# Altium project KeyBoard.PrjPcb
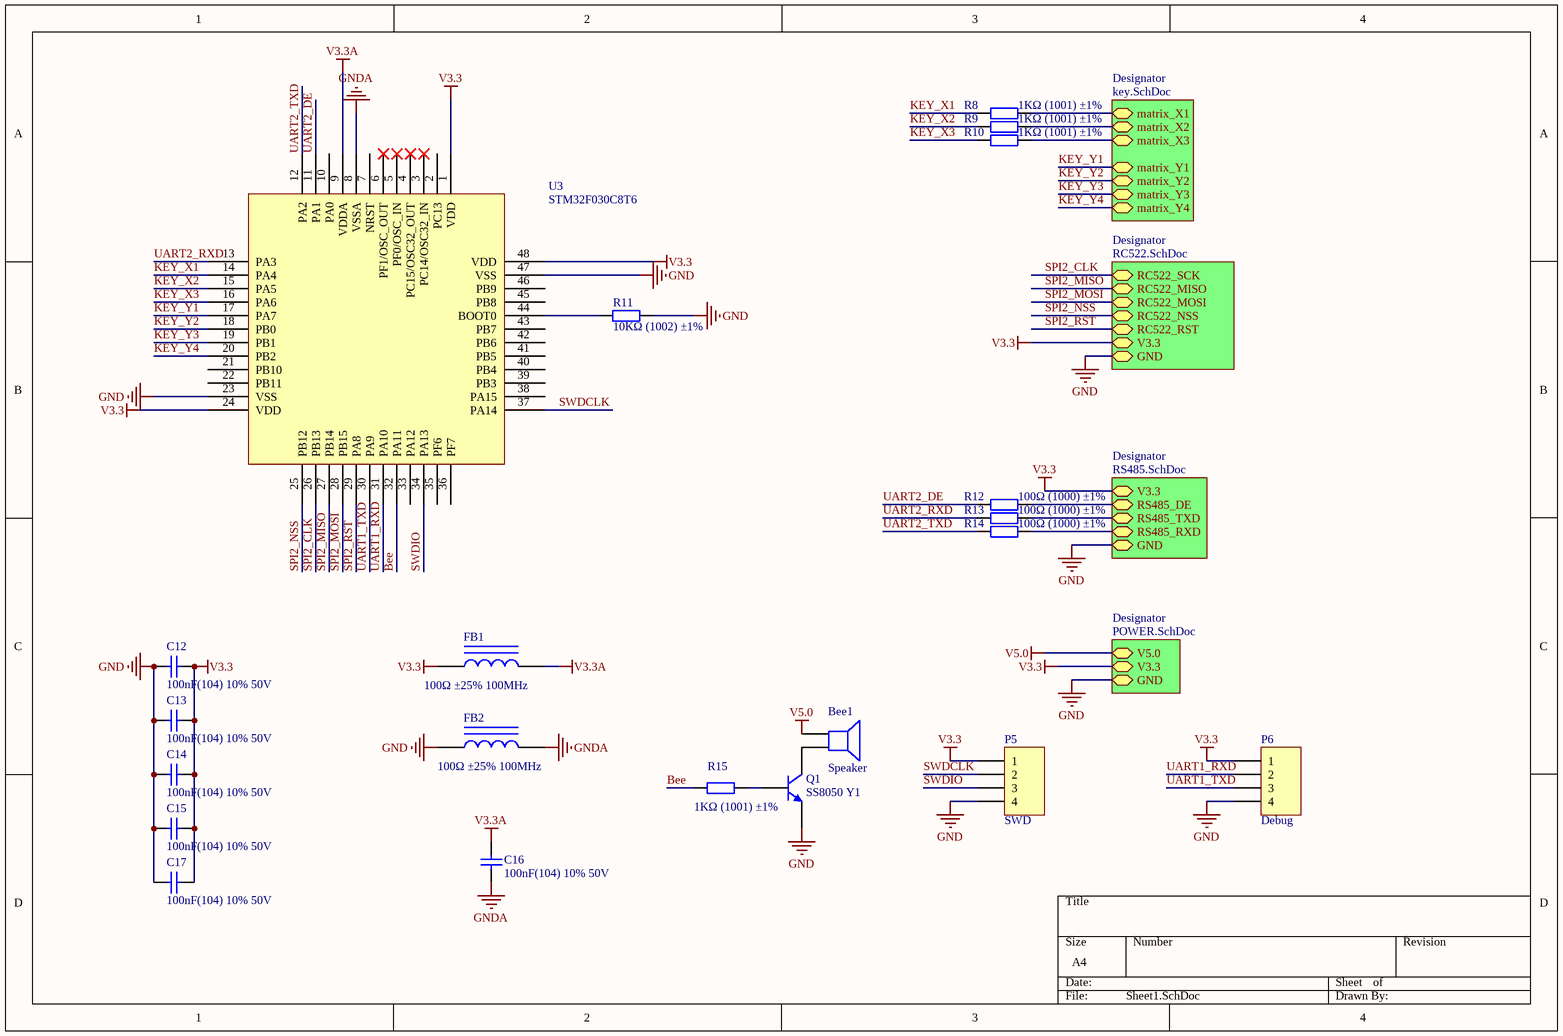
[diagram p0: Sheet1.SchDoc]
5 sheets, 49 parts. Net scope: strictly hierarchical (ports join the sheet entries above them; power ports are local).
Board file: PCB.PcbDoc
Sheets:
  Sheet1.SchDoc
    Designator = key.SchDoc
    Designator = RC522.SchDoc
    Designator = RS485.SchDoc
    Designator = POWER.SchDoc

## Sheet Sheet1.SchDoc
size A4

### Parts
Bee1  Speaker  [Bee]
C12  100nF(104) 10% 50V  [0805_C]
C13  100nF(104) 10% 50V  [0805_C]
C14  100nF(104) 10% 50V  [0805_C]
C15  100nF(104) 10% 50V  [0805_C]
C16  100nF(104) 10% 50V  [0805_C]
C17  100nF(104) 10% 50V  [0805_C]
FB1  100Ω ±25% 100MHz  [0805_L]
FB2  100Ω ±25% 100MHz  [0805_L]
P5  SWD  [HDR1X4]
P6  Debug  [HDR1X4]
Q1  SS8050 Y1  [SOT-23(SOT-23-3)]
R8  1KΩ (1001) ±1%  [0805_R]
R9  1KΩ (1001) ±1%  [0805_R]
R10  1KΩ (1001) ±1%  [0805_R]
R11  10KΩ (1002) ±1%  [0805_R]
R12  100Ω (1000) ±1%  [0805_R]
R13  100Ω (1000) ±1%  [0805_R]
R14  100Ω (1000) ±1%  [0805_R]
R15  1KΩ (1001) ±1%  [0805_R]
U3  STM32F030C8T6  [LQFP-48_7x7x05P]

### Sub-sheets
Designator = key.SchDoc: matrix_Y2, matrix_Y4, matrix_X1, matrix_Y1, matrix_X3, matrix_Y3, matrix_X2
Designator = RC522.SchDoc: RC522_SCK, RC522_MISO, RC522_MOSI, RC522_NSS, V3.3, RC522_RST, GND
Designator = RS485.SchDoc: V3.3, RS485_RXD, RS485_TXD, RS485_DE, GND
Designator = POWER.SchDoc: V5.0, V3.3, GND

### Nets
GND: C12.1 C13.1 C14.1 C15.1 C17.1 FB2.1 P5.4 P6.4 Q1.2(E) R11.2 U3.23(VSS) U3.47(VSS) ; sheet Designator/GND, sheet Designator/GND, sheet Designator/GND
GNDA: C16.1 FB2.2 U3.8(VSSA)
V3.3: C12.2 C13.2 C14.2 C15.2 C17.2 FB1.1 P5.1 P6.1 U3.1(VDD) U3.24(VDD) U3.48(VDD) ; sheet Designator/V3.3, sheet Designator/V3.3, sheet Designator/V3.3
V3.3A: C16.2 FB1.2 U3.9(VDDA)
V5.0: Bee1.1 ; sheet Designator/V5.0
Bee: R15.1 U3.32(PA11)
KEY_X1: R8.1 U3.14(PA4)
KEY_X2: R9.1 U3.15(PA5)
KEY_X3: R10.1 U3.16(PA6)
KEY_Y1: U3.17(PA7) ; sheet Designator/matrix_Y1
KEY_Y2: U3.18(PB0) ; sheet Designator/matrix_Y2
KEY_Y3: U3.19(PB1) ; sheet Designator/matrix_Y3
KEY_Y4: U3.20(PB2) ; sheet Designator/matrix_Y4
matrix_X1: R8.2 ; sheet Designator/matrix_X1
matrix_X2: R9.2 ; sheet Designator/matrix_X2
matrix_X3: R10.2 ; sheet Designator/matrix_X3
RS485_DE: R12.2 ; sheet Designator/RS485_DE
RS485_RXD: R14.2 ; sheet Designator/RS485_RXD
RS485_TXD: R13.2 ; sheet Designator/RS485_TXD
SPI2_CLK: U3.26(PB13) ; sheet Designator/RC522_SCK  [project net RC522_SCK]
SPI2_MISO: U3.27(PB14) ; sheet Designator/RC522_MISO  [project net RC522_MISO]
SPI2_MOSI: U3.28(PB15) ; sheet Designator/RC522_MOSI  [project net RC522_MOSI]
SPI2_NSS: U3.25(PB12) ; sheet Designator/RC522_NSS  [project net RC522_NSS]
SPI2_RST: U3.29(PA8) ; sheet Designator/RC522_RST  [project net RC522_RST]
SWDCLK: P5.2 U3.37(PA14)
SWDIO: P5.3 U3.34(PA13)
UART1_RXD: P6.2 U3.31(PA10)
UART1_TXD: P6.3 U3.30(PA9)
UART2_DE: R12.1 U3.11(PA1)
UART2_RXD: R13.1 U3.13(PA3)
UART2_TXD: R14.1 U3.12(PA2)
NetBee1_2: Bee1.2 Q1.3(C)
NetQ1_1: Q1.1(B) R15.2
NetR11_1: R11.1 U3.44(BOOT0)

Not connected (* = marked no-connect by the designer): U3 2(PC13) 3(PC14/OSC32_IN)* 4(PC15/OSC32_OUT)* 5(PF0/OSC_IN)* 6(PF1/OSC_OUT)* 7(NRST) 10(PA0) 21(PB10) 22(PB11) 33(PA12) 35(PF6) 36(PF7) 38(PA15) 39(PB3) 40(PB4) 41(PB5) 42(PB6) 43(PB7) 45(PB8) 46(PB9)

### Library data of the parts
Bee1 = Speaker: Loudspeaker; Published: 24-Mar-1999; LatestRevisionDate: 17-Jul-2002; LatestRevisionNote: Re-released for DXP Platform.; PackageReference: PIN2; Publisher: Altium Limited
C12-C17 = 0805 100nF(104) 10% 50V: 贴片电容; ComponentLink1Description: 供应商链接; ComponentLink1URL: http://www.szlcsc.com/product/details_50686.html; Package: 0805; Supplier: LC; SuppliersPartNumber: C49678
FB1 FB2 = 0805 100Ω 25% 100MHz: 贴片磁珠; ComponentLink1Description: 供应商链接; ComponentLink1URL: http://www.szlcsc.com/product/details_1367.html; Package: 0805; Supplier: LC; SuppliersPartNumber: C1015
P5 P6 = Header 4: Header, 4-Pin; LatestRevisionDate: 17-Jul-2002; LatestRevisionNote: Re-released for DXP Platform.; Publisher: Altium Limited
Q1 = SOT-23 SS8050 Y1: 三极管; ComponentLink1Description: 供应商链接; ComponentLink1URL: http://www.szlcsc.com/product/details_2507.html; Package: SOT-23; Supplier: LC; SuppliersPartNumber: C2150
R8-R10 R15 = 0805 1KΩ (1001) 1%: 贴片电阻; ComponentLink1Description: 供应商链接; ComponentLink1URL: http://www.szlcsc.com/product/details_18201.html; Package: 0805; Supplier: LC; SuppliersPartNumber: C17513
R11 = 0805 10KΩ (1002) 1%: 贴片电阻; ComponentLink1Description: 供应商链接; ComponentLink1URL: http://www.szlcsc.com/product/details_18102.html; Package: 0805; Supplier: LC; SuppliersPartNumber: C17414
R12-R14 = 0805 100Ω (1000) 1%: 贴片电阻; ComponentLink1Description: 供应商链接; ComponentLink1URL: http://www.szlcsc.com/product/details_18096.html; Package: 0805; Supplier: LC; SuppliersPartNumber: C17408
U3 = STM32F030C8T6: ARM; ComponentLink1Description: 供应商链接; ComponentLink1URL: http://www.szlcsc.com/product/details_24662.html; Package: LQFP-48_7x7x05P; Supplier: LC; SuppliersPartNumber: C23922

## Sheet key.SchDoc
size A4
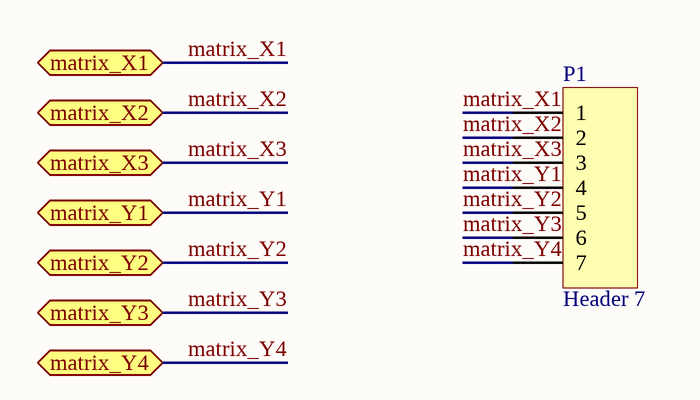
[diagram p1: key.SchDoc]

### Parts
P1  Header 7  [HDR1X7]

### Ports
matrix_X1, matrix_X2, matrix_X3, matrix_Y1, matrix_Y2, matrix_Y3, matrix_Y4

### Nets
matrix_X1: P1.1 ; port matrix_X1
matrix_X2: P1.2 ; port matrix_X2
matrix_X3: P1.3 ; port matrix_X3
matrix_Y1: P1.4 ; port matrix_Y1  [project net KEY_Y1]
matrix_Y2: P1.5 ; port matrix_Y2  [project net KEY_Y2]
matrix_Y3: P1.6 ; port matrix_Y3  [project net KEY_Y3]
matrix_Y4: P1.7 ; port matrix_Y4  [project net KEY_Y4]

### Library data of the parts
P1 = Header 7: Header, 7-Pin; LatestRevisionDate: 17-Jul-2002; LatestRevisionNote: Re-released for DXP Platform.; Publisher: Altium Limited

## Sheet RC522.SchDoc
size A4
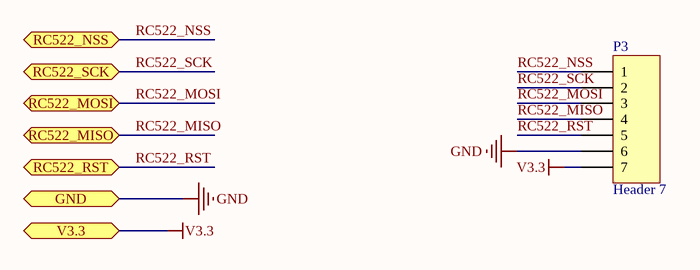
[diagram p2: RC522.SchDoc]

### Parts
P3  Header 7  [HDR1X7]

### Ports
GND, RC522_MISO, RC522_MOSI, RC522_NSS, RC522_RST, RC522_SCK, V3.3

### Nets
GND: P3.6 ; port GND
V3.3: P3.7 ; port V3.3
RC522_MISO: P3.4 ; port RC522_MISO
RC522_MOSI: P3.3 ; port RC522_MOSI
RC522_NSS: P3.1 ; port RC522_NSS
RC522_RST: P3.5 ; port RC522_RST
RC522_SCK: P3.2 ; port RC522_SCK

### Library data of the parts
P3 = Header 7: Header, 7-Pin; LatestRevisionDate: 17-Jul-2002; LatestRevisionNote: Re-released for DXP Platform.; Publisher: Altium Limited

## Sheet RS485.SchDoc
size A4
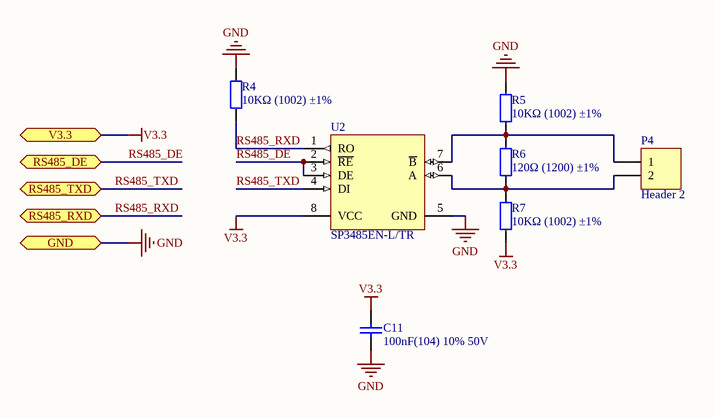
[diagram p3: RS485.SchDoc]

### Parts
C11  100nF(104) 10% 50V  [0805_C]
P4  Header 2  [KF128-2P]
R4  10KΩ (1002) ±1%  [0805_R]
R5  10KΩ (1002) ±1%  [0805_R]
R6  120Ω (1200) ±1%  [0805_R]
R7  10KΩ (1002) ±1%  [0805_R]
U2  SP3485EN-L/TR  [SOIC-8_150mil]

### Ports
GND, RS485_DE, RS485_RXD, RS485_TXD, V3.3

### Nets
GND: C11.2 R4.2 R5.2 U2.5(GND) ; port GND
V3.3: C11.1 R7.1 U2.8(VCC) ; port V3.3
RS485_DE: U2.2(~{RE}) U2.3(DE) ; port RS485_DE
RS485_RXD: R4.1 U2.1(RO) ; port RS485_RXD
RS485_TXD: U2.4(DI) ; port RS485_TXD
NetP4_1: P4.1 R5.1 R6.2 U2.7(~{B})
NetP4_2: P4.2 R6.1 R7.2 U2.6(A)

### Library data of the parts
C11 = 0805 100nF(104) 10% 50V: 贴片电容; ComponentLink1Description: 供应商链接; ComponentLink1URL: http://www.szlcsc.com/product/details_50686.html; Package: 0805; Supplier: LC; SuppliersPartNumber: C49678
P4 = Header 2: Header, 2-Pin; LatestRevisionDate: 17-Jul-2002; LatestRevisionNote: Re-released for DXP Platform.; Publisher: Altium Limited
R4 R5 R7 = 0805 10KΩ (1002) 1%: 贴片电阻; ComponentLink1Description: 供应商链接; ComponentLink1URL: http://www.szlcsc.com/product/details_18102.html; Package: 0805; Supplier: LC; SuppliersPartNumber: C17414
R6 = 0805 120Ω (1200) 1%: 贴片电阻; ComponentLink1Description: 供应商链接; ComponentLink1URL: http://www.szlcsc.com/product/details_18125.html; Package: 0805; Supplier: LC; SuppliersPartNumber: C17437
U2 = SP3485EN-L/TR_[C8963]: RS-485/RS-422; ComponentLink1Description: 供应商链接; ComponentLink1URL: http://www.szlcsc.com/product/details_9482.html; Package: SOIC-8; Supplier: LC; SuppliersPartNumber: C8963

## Sheet POWER.SchDoc
size A4
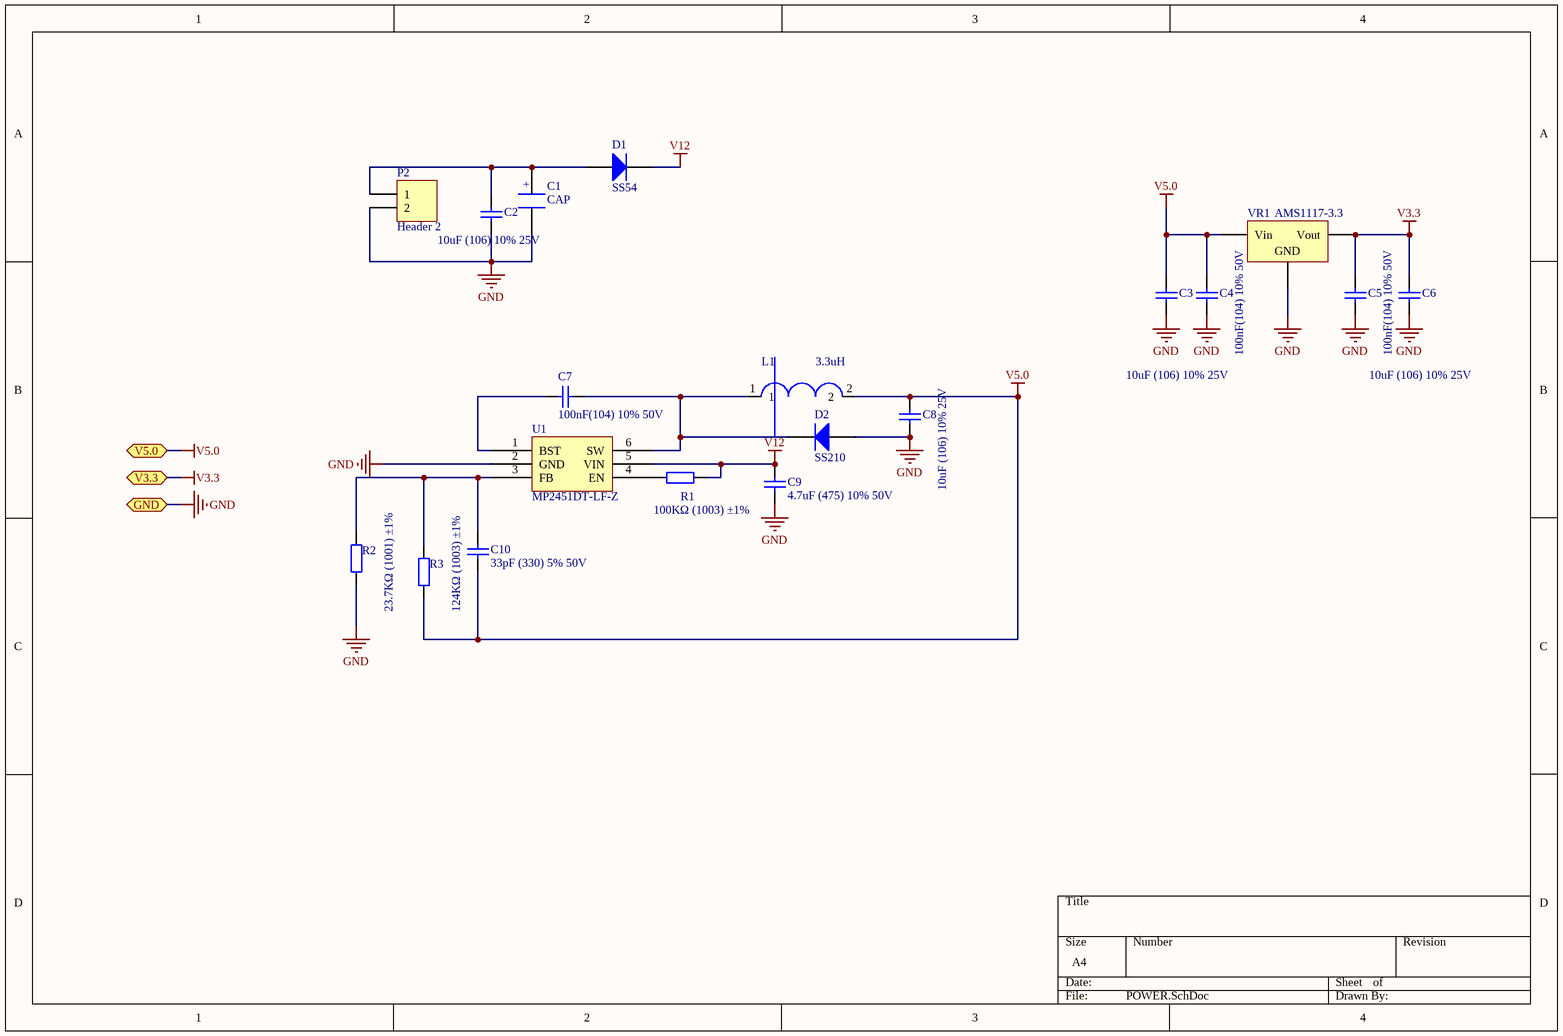
[diagram p4: POWER.SchDoc]

### Parts
C1  CAP  [8X12_CAP]
C2  10uF (106) 10% 25V  [0805_C]
C3  10uF (106) 10% 25V  [0805_C]
C4  100nF(104) 10% 50V  [0805_C]
C5  100nF(104) 10% 50V  [0805_C]
C6  10uF (106) 10% 25V  [0805_C]
C7  100nF(104) 10% 50V  [0805_C]
C8  10uF (106) 10% 25V  [0805_C]
C9  4.7uF (475) 10% 50V  [1206_C]
C10  33pF (330) 5% 50V  [0805_C]
D1  SS54  [SMA(DO-214AC)_S1]
D2  SS210  [SMA(DO-214AC)_S1]
L1  3.3uH  [L_4030]
P2  Header 2  [WJ25]
R1  100KΩ (1003) ±1%  [0805_R]
R2  23.7KΩ (1001) ±1%  [0805_R]
R3  124KΩ (1003) ±1%  [0805_R]
U1  MP2451DT-LF-Z  [SOT-23-6]
VR1  AMS1117-3.3  [SOT-223]

### Ports
GND, V3.3, V5.0

### Nets
GND: C1.2 C2.1 C3.1 C4.1 C5.1 C6.1 C8.1 C9.1 D2.1(A) P2.2 R2.1 U1.2(GND) VR1.1(GND) ; port GND
V3.3: C5.2 C6.2 VR1.2(Vout) ; port V3.3
V5.0: C3.2 C4.2 C8.2 C10.1 L1.2 R3.1 VR1.3(Vin) ; port V5.0
V12: C9.2 D1.2(K) R1.1 U1.5(VIN)
NetC1_1: C1.1 C2.2 D1.1(A) P2.1
NetC7_1: C7.1 D2.2(K) L1.1 U1.6(SW)
NetC7_2: C7.2 U1.1(BST)
NetC10_2: C10.2 R2.2 R3.2 U1.3(FB)
NetR1_2: R1.2 U1.4(EN)

### Notes on the sheet
- (in symbol CAP) +

### Library data of the parts
C2 C3 C6 C8 = 0805 10uF (106) 10% 25V: 贴片电容; ComponentLink1Description: 供应商链接; ComponentLink1URL: http://www.szlcsc.com/product/details_16532.html; Package: 0805; Supplier: LC; SuppliersPartNumber: C15850
C4 C5 C7 = 0805 100nF(104) 10% 50V: 贴片电容; ComponentLink1Description: 供应商链接; ComponentLink1URL: http://www.szlcsc.com/product/details_50686.html; Package: 0805; Supplier: LC; SuppliersPartNumber: C49678
C9 = 1206 4.7uF (475) 10% 50V: 贴片电容; ComponentLink1Description: 供应商链接; ComponentLink1URL: http://www.szlcsc.com/product/details_30577.html; Package: 1206; Supplier: LC; SuppliersPartNumber: C29823
C10 = 0805 33pF (330) 5% 50V: 贴片电容; ComponentLink1Description: 供应商链接; ComponentLink1URL: http://www.szlcsc.com/product/details_2166.html; Package: 0805; Supplier: LC; SuppliersPartNumber: C1814
D1 = SMA(DO-214AC) SS54: 二极管; ComponentLink1Description: 供应商链接; ComponentLink1URL: http://www.szlcsc.com/product/details_23178.html; Package: SMA(DO-214AC); Supplier: LC; SuppliersPartNumber: C22452
D2 = SMA(DO-214AC) SS210: 二极管; ComponentLink1Description: 供应商链接; ComponentLink1URL: http://www.szlcsc.com/product/details_15669.html; Package: SMA(DO-214AC); Supplier: LC; SuppliersPartNumber: C14996
L1 = 33uH
P2 = Header 2: Header, 2-Pin; LatestRevisionDate: 17-Jul-2002; LatestRevisionNote: Re-released for DXP Platform.; Publisher: Altium Limited
R1 R3 = 0805 100KΩ (1003) 1%: 贴片电阻; ComponentLink1Description: 供应商链接; ComponentLink1URL: http://www.szlcsc.com/product/details_18095.html; Package: 0805; Supplier: LC; SuppliersPartNumber: C17407
R2 = 0805 1KΩ (1001) 1%: 贴片电阻; ComponentLink1Description: 供应商链接; ComponentLink1URL: http://www.szlcsc.com/product/details_18201.html; Package: 0805; Supplier: LC; SuppliersPartNumber: C17513
U1 = MP2451DT-LF-Z_[C14123]: DC-DC芯片; ComponentLink1Description: 供应商链接; ComponentLink1URL: http://www.szlcsc.com/product/details_14780.html; Package: SOT-23-6; Supplier: LC; SuppliersPartNumber: C14123
VR1 = SOT-223 AMS1117-3.3: 低压差线性稳压(LDO); ComponentLink1Description: 供应商链接; ComponentLink1URL: http://www.szlcsc.com/product/details_6652.html; Package: SOT-223; Supplier: LC; SuppliersPartNumber: C6186

## Nets that join several sheets
GND: Sheet1 (12 pins), RC522 (P3.6), RS485 (C11.2 R4.2 R5.2 U2.5), POWER (13 pins)
V3.3: Sheet1 (11 pins), RC522 (P3.7), RS485 (C11.1 R7.1 U2.8), POWER (C5.2 C6.2 VR1.2)
V5.0: Sheet1 (Bee1.1), POWER (7 pins)
KEY_Y1: Sheet1 (U3.17), key (P1.4)
KEY_Y2: Sheet1 (U3.18), key (P1.5)
KEY_Y3: Sheet1 (U3.19), key (P1.6)
KEY_Y4: Sheet1 (U3.20), key (P1.7)
matrix_X1: Sheet1 (R8.2), key (P1.1)
matrix_X2: Sheet1 (R9.2), key (P1.2)
matrix_X3: Sheet1 (R10.2), key (P1.3)
RC522_MISO: Sheet1 (U3.27), RC522 (P3.4)
RC522_MOSI: Sheet1 (U3.28), RC522 (P3.3)
RC522_NSS: Sheet1 (U3.25), RC522 (P3.1)
RC522_RST: Sheet1 (U3.29), RC522 (P3.5)
RC522_SCK: Sheet1 (U3.26), RC522 (P3.2)
RS485_DE: Sheet1 (R12.2), RS485 (U2.2 U2.3)
RS485_RXD: Sheet1 (R14.2), RS485 (R4.1 U2.1)
RS485_TXD: Sheet1 (R13.2), RS485 (U2.4)